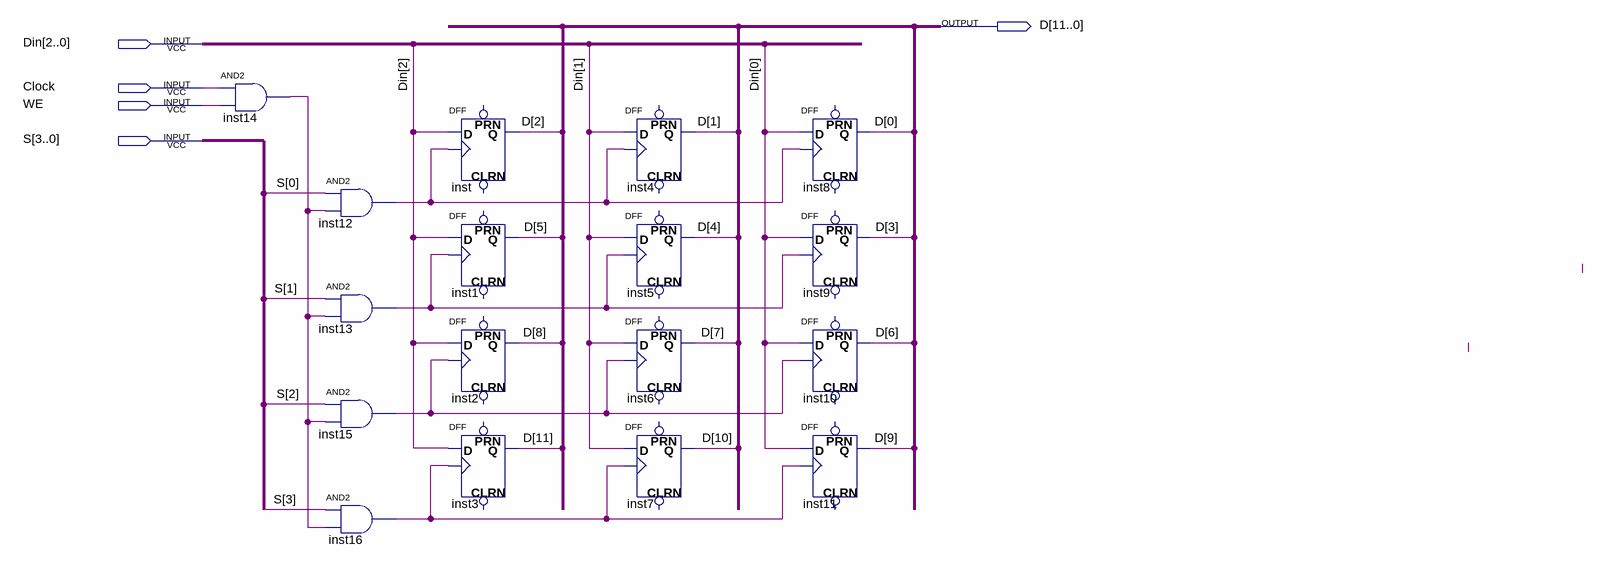
[diagram p0: schematic sheet]
// Quartus schematic Register4x3.bdf as structural Verilog: 17 symbols, 5 pins
module Register4x3 (
  input  [2:0] Din,
  input  Clock,
  input  WE,
  input  [3:0] S,
  output [11:0] D
);

  wire inst12_out, inst13_out, inst14_out, inst15_out, inst16_out;

  and inst14 (inst14_out, Clock, WE);
  and inst12 (inst12_out, S[0], inst14_out);
  and inst13 (inst13_out, S[1], inst14_out);
  and inst15 (inst15_out, S[2], inst14_out);
  and inst16 (inst16_out, S[3], inst14_out);
  DFF inst (.CLK(inst12_out), .D(Din[2]), .Q(D[2]));  // open: CLRN, PRN
  DFF inst1 (.CLK(inst13_out), .D(Din[2]), .Q(D[5]));  // open: CLRN, PRN
  DFF inst2 (.CLK(inst15_out), .D(Din[2]), .Q(D[8]));  // open: CLRN, PRN
  DFF inst3 (.CLK(inst16_out), .D(Din[2]), .Q(D[11]));  // open: CLRN, PRN
  DFF inst4 (.CLK(inst12_out), .D(Din[1]), .Q(D[1]));  // open: CLRN, PRN
  DFF inst5 (.CLK(inst13_out), .D(Din[1]), .Q(D[4]));  // open: CLRN, PRN
  DFF inst6 (.CLK(inst15_out), .D(Din[1]), .Q(D[7]));  // open: CLRN, PRN
  DFF inst7 (.CLK(inst16_out), .D(Din[1]), .Q(D[10]));  // open: CLRN, PRN
  DFF inst8 (.CLK(inst12_out), .D(Din[0]), .Q(D[0]));  // open: CLRN, PRN
  DFF inst9 (.CLK(inst13_out), .D(Din[0]), .Q(D[3]));  // open: CLRN, PRN
  DFF inst10 (.CLK(inst15_out), .D(Din[0]), .Q(D[6]));  // open: CLRN, PRN
  DFF inst11 (.CLK(inst16_out), .D(Din[0]), .Q(D[9]));  // open: CLRN, PRN
endmodule
